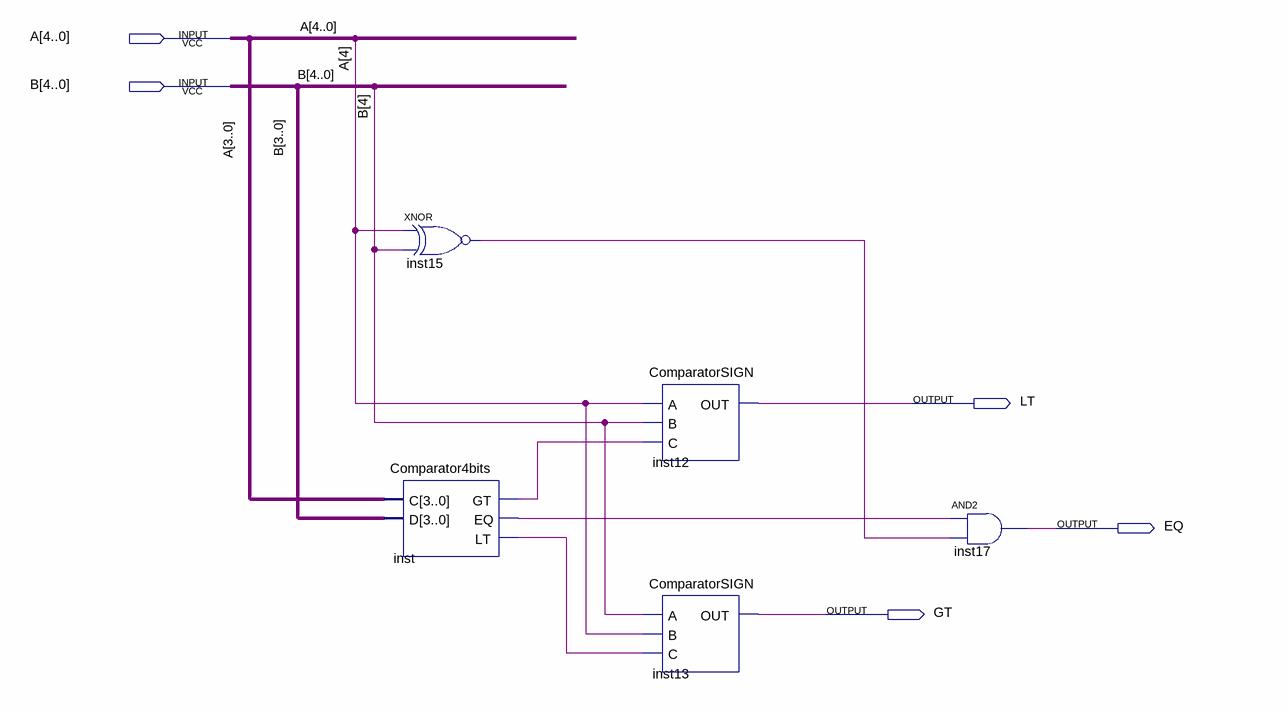
[diagram p0: schematic sheet]
// Quartus schematic Comparator5bits.bdf as structural Verilog: 5 symbols, 5 pins
module Comparator5bits (
  input  [4:0] A,
  input  [4:0] B,
  output LT,
  output EQ,
  output GT
);

  wire inst15_out, inst_eq, inst_gt, inst_lt;

  xnor inst15 (inst15_out, A[4], B[4]);
  Comparator4bits inst (.C(A[3:0]), .D(B[3:0]), .GT(inst_gt), .EQ(inst_eq), .LT(inst_lt));
  ComparatorSIGN inst12 (.A(A[4]), .B(B[4]), .C(inst_gt), .OUT(LT));
  ComparatorSIGN inst13 (.A(B[4]), .B(A[4]), .C(inst_lt), .OUT(GT));
  and inst17 (EQ, inst_eq, inst15_out);
endmodule
